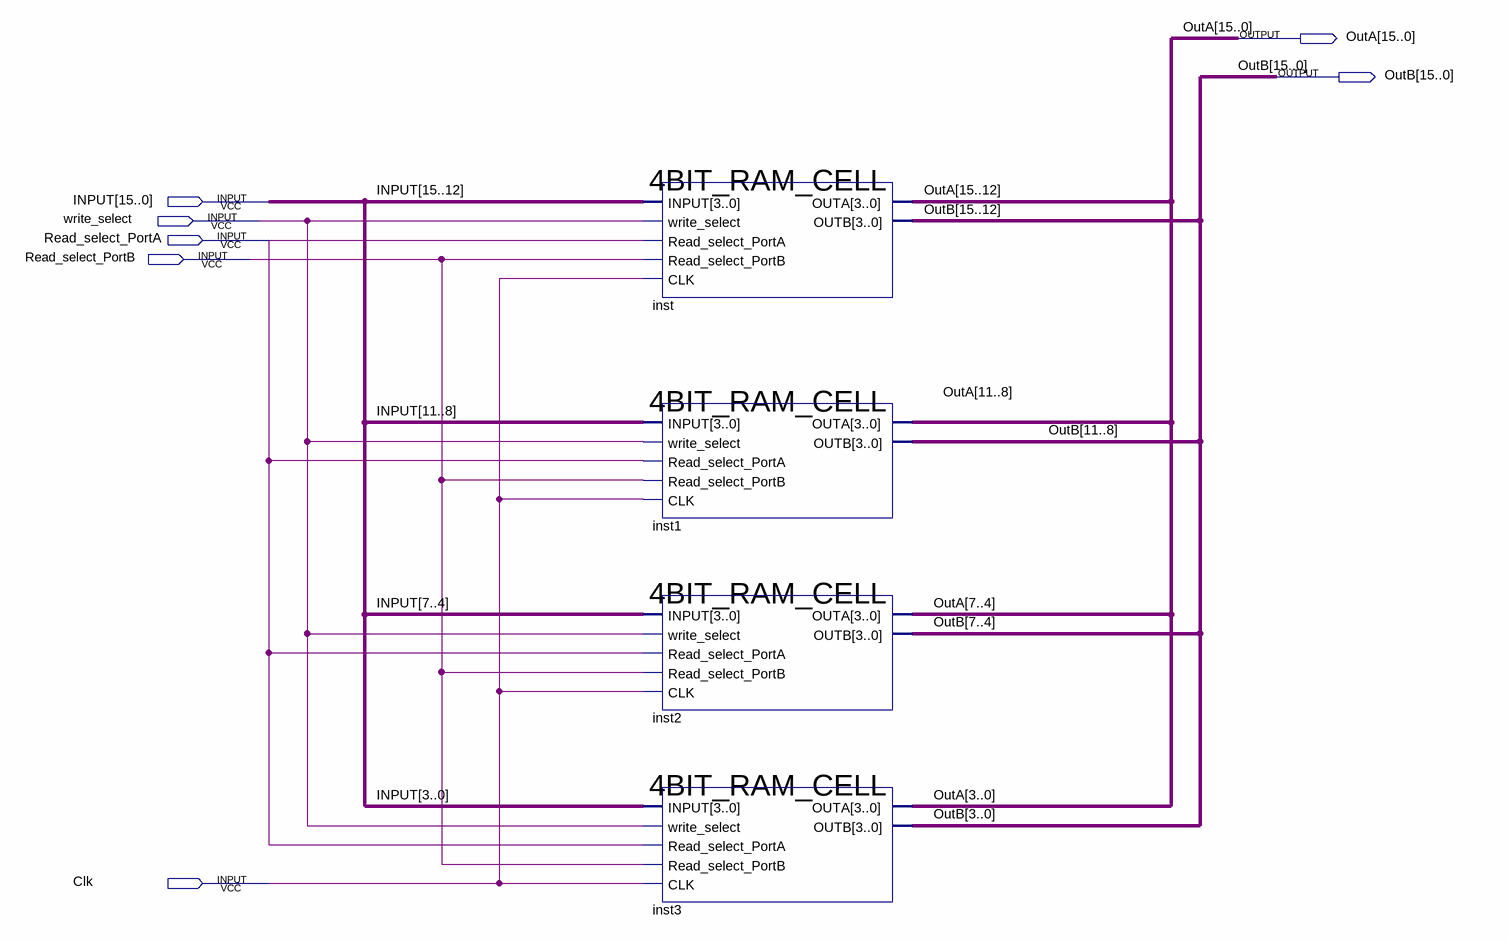
[diagram p0: schematic sheet]
// Quartus schematic 16BIT_RAM_CELL.bdf as structural Verilog: 4 symbols, 7 pins
module \16BIT_RAM_CELL  (
  input  [15:0] INPUT,
  input  write_select,
  input  Read_select_PortA,
  input  Read_select_PortB,
  input  Clk,
  output [15:0] OutA,
  output [15:0] OutB
);

  \4BIT_RAM_CELL  inst (
    .INPUT(INPUT[15:12]), .write_select(write_select), .Read_select_PortA(Read_select_PortA),
    .Read_select_PortB(Read_select_PortB), .CLK(Clk), .OUTA(OutA[15:12]), .OUTB(OutB[15:12]));
  \4BIT_RAM_CELL  inst1 (
    .INPUT(INPUT[11:8]), .write_select(write_select), .Read_select_PortA(Read_select_PortA),
    .Read_select_PortB(Read_select_PortB), .CLK(Clk), .OUTA(OutA[11:8]), .OUTB(OutB[11:8]));
  \4BIT_RAM_CELL  inst2 (
    .INPUT(INPUT[7:4]), .write_select(write_select), .Read_select_PortA(Read_select_PortA),
    .Read_select_PortB(Read_select_PortB), .CLK(Clk), .OUTA(OutA[7:4]), .OUTB(OutB[7:4]));
  \4BIT_RAM_CELL  inst3 (
    .INPUT(INPUT[3:0]), .write_select(write_select), .Read_select_PortA(Read_select_PortA),
    .Read_select_PortB(Read_select_PortB), .CLK(Clk), .OUTA(OutA[3:0]), .OUTB(OutB[3:0]));
endmodule
